# Altium schematic sheet cpu.SchDoc
size A4
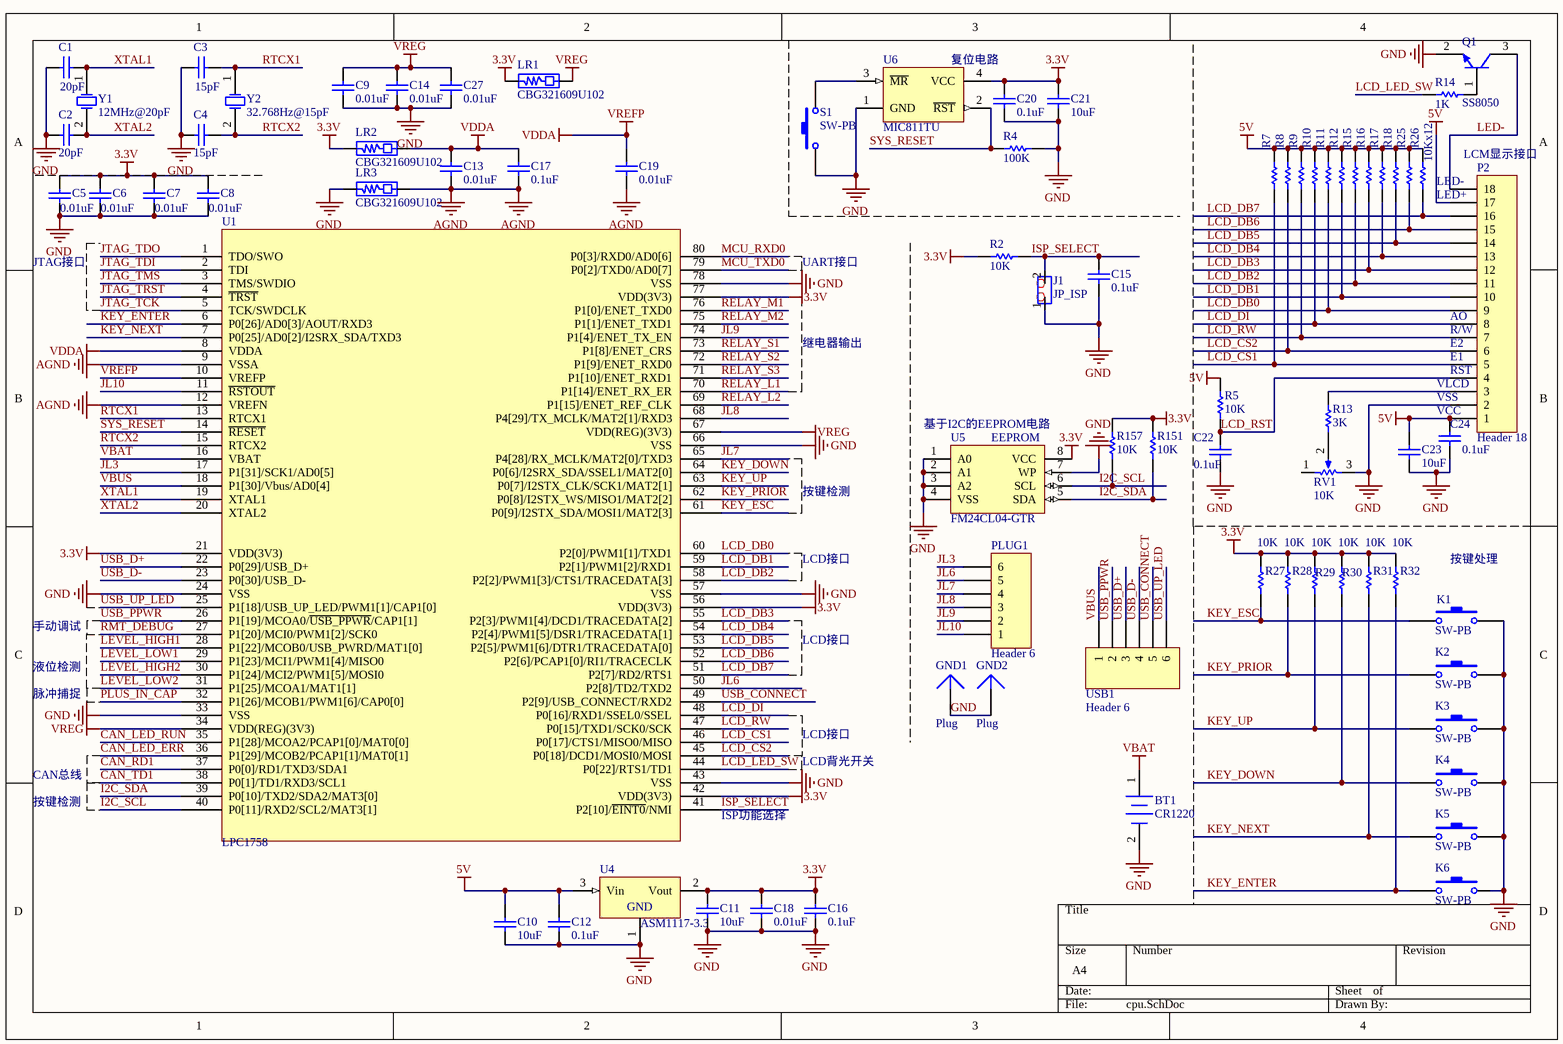
[diagram p0: cpu.SchDoc]

## Parts
BT1  CR1220  [BAT-CR1220A]
C1  20pF  [CAPC2012M]
C2  20pF  [CAPC2012M]
C3  15pF  [CAPC2012M]
C4  15pF  [CAPC2012M]
C5  0.01uF  [CAPC2012M]
C6  0.01uF  [CAPC2012M]
C7  0.01uF  [CAPC2012M]
C8  0.01uF  [CAPC2012M]
C9  0.01uF  [CAPC2012M]
C10  10uF  [CAPC2012M]
C11  10uF  [CAPC2012M]
C12  0.1uF  [CAPC2012M]
C13  0.01uF  [CAPC2012M]
C14  0.01uF  [CAPC2012M]
C15  0.1uF  [CAPC2012M]
C16  0.1uF  [CAPC2012M]
C17  0.1uF  [CAPC2012M]
C18  0.01uF  [CAPC2012M]
C19  0.01uF  [CAPC2012M]
C20  0.1uF  [CAPC2012M]
C21  10uF  [CAPC2012M]
C22  0.1uF  [CAPC2012M]
C23  10uF  [CAPC2012M]
C24  0.1uF  [CAPC2012M]
C27  0.01uF  [CAPC2012M]
GND1  Plug  [PIN1]
GND2  Plug  [PIN1]
J1  JP_ISP  [DS-01]
K1  SW-PB  [PBST-4S]
K2  SW-PB  [PBST-4S]
K3  SW-PB  [PBST-4S]
K4  SW-PB  [PBST-4S]
K5  SW-PB  [PBST-4S]
K6  SW-PB  [PBST-4S]
LR1  CBG321609U102  [RESC3216M]
LR2  CBG321609U102  [RESC3216M]
LR3  CBG321609U102  [RESC3216M]
P2  Header 18  [HDR1X18]
PLUG1  Header 6  [HDR1X6]
Q1  SS8050  [SOT-23_N]
R2  10K  [RESC2012M]
R4  100K  [RESC2012M]
R5  10K  [RESC2012M]
R7  10K  [RESC2012M]  (value not drawn)
R8  10K  [RESC2012M]  (value not drawn)
R9  10K  [RESC2012M]  (value not drawn)
R10  10K  [RESC2012M]  (value not drawn)
R11  10K  [RESC2012M]  (value not drawn)
R12  10K  [RESC2012M]  (value not drawn)
R13  3K  [RESC2012M]
R14  1K  [RESC2012M]
R15  10K  [RESC2012M]  (value not drawn)
R16  10K  [RESC2012M]  (value not drawn)
R17  10K  [RESC2012M]  (value not drawn)
R18  10K  [RESC2012M]  (value not drawn)
R25  10K  [RESC2012M]  (value not drawn)
R26  10K  [RESC2012M]  (value not drawn)
R27  10K  [RESC2012M]
R28  10K  [RESC2012M]
R29  10K  [RESC2012M]
R30  10K  [RESC2012M]
R31  10K  [RESC2012M]
R32  10K  [RESC2012M]
R151  10K  [RESC2012M]
R157  10K  [RESC2012M]
RV1  10K  [VR5S]
S1  SW-PB  [DPST-4S]
U1  LPC1758  [LQFP80_M]
U4  ASM1117-3.3  [SOT-223]
U5  FM24CL04-GTR  [SO-8]
U6  MIC811TU  [SOT143_N]
USB1  Header 6  [HDR1X6]
Y1  12MHz@20pF  [HC_SOC]
Y2  32.768Hz@15pF  [HC-RTC]

## Nets
3.3V: C5.2 C6.2 C7.2 C8.2 C11.2 C16.2 C18.2 C20.2 C21.2 LR1.1 LR2.1 R2.1 R27.2 R28.2 R29.2 R30.2 R31.2 R32.2 R151.2 R157.1 U1.21(VDD(3V3)) U1.42(VDD(3V3)) U1.56(VDD(3V3)) U1.77(VDD(3V3)) U4.2(Vout) U5.8(VCC) U6.4(VCC)
5V: C10.2 C12.2 C23.2 C24.1 P2.1 P2.17 R5.1 R7.1 R8.1 R9.1 R10.1 R11.1 R12.1 R15.1 R16.1 R17.1 R18.1 R25.1 R26.1 U4.3(Vin)
AGND: C13.1 C17.1 C19.1 LR3.2 U1.9(VSSA) U1.12(VREFN)
GND: BT1.2(-) C1.2 C2.2 C3.2 C4.2 C5.1 C6.1 C7.1 C8.1 C9.1 C10.1 C11.1 C12.1 C14.1 C15.2 C16.1 C18.1 C20.1 C21.1 C22.2 C23.1 C24.2 C27.1 GND1.1 GND2.1 J1.1 K1.2 K2.2 K3.2 K4.2 K5.2 K6.2 LR3.1 P2.2 Q1.2(E) R4.2 RV1.3(BOT) S1.1 U1.24(VSS) U1.33(VSS) U1.43(VSS) U1.57(VSS) U1.66(VSS) U1.78(VSS) U4.1(GND) U5.1(A0) U5.2(A1) U5.3(A2) U5.4(VSS) U5.7(WP) U6.1(GND)
VBAT: BT1.1(+) U1.16(VBAT)
VREFP: C13.2 C17.2 C19.2 LR2.2 U1.8(VDDA) U1.10(VREFP)  [also labelled VDDA]
VREG: C9.2 C14.2 C27.2 LR1.2 U1.34(VDD(REG)(3V3)) U1.67(VDD(REG)(3V3))
CAN_LED_ERR: U1.36(P1[29]/MCOB2/PCAP1[1]/MAT0[1])
CAN_LED_RUN: U1.35(P1[28]/MCOA2/PCAP1[0]/MAT0[0])
CAN_RD1: U1.37(P0[0]/RD1/TXD3/SDA1)
CAN_TD1: U1.38(P0[1]/TD1/RXD3/SCL1)
I2C_SCL: R157.2 U1.40(P0[11]/RXD2/SCL2/MAT3[1]) U5.6(SCL)
I2C_SDA: R151.1 U1.39(P0[10]/TXD2/SDA2/MAT3[0]) U5.5(SDA)
ISP_SELECT: C15.1 J1.2 R2.2 U1.41(P2[10]/~{EINT0}/NMI)
JL3: PLUG1.6 U1.17(P1[31]/SCK1/AD0[5])
JL6: PLUG1.5 U1.50(P2[8]/TD2/TXD2)
JL7: PLUG1.4 U1.65(P4[28]/RX_MCLK/MAT2[0]/TXD3)
JL8: PLUG1.3 U1.68(P4[29]/TX_MCLK/MAT2[1]/RXD3)
JL9: PLUG1.2 U1.74(P1[4]/ENET_TX_EN)
JL10: PLUG1.1 U1.11(~{RSTOUT})
JTAG_TCK: U1.5(TCK/SWDCLK)
JTAG_TDI: U1.2(TDI)
JTAG_TDO: U1.1(TDO/SWO)
JTAG_TMS: U1.3(TMS/SWDIO)
JTAG_TRST: U1.4(~{TRST})
KEY_DOWN: K4.1 R30.1 U1.64(P0[6]/I2SRX_SDA/SSEL1/MAT2[0])
KEY_ENTER: K6.1 R32.1 U1.6(P0[26]/AD0[3]/AOUT/RXD3)
KEY_ESC: K1.1 R27.1 U1.61(P0[9]/I2STX_SDA/MOSI1/MAT2[3])
KEY_NEXT: K5.1 R31.1 U1.7(P0[25]/AD0[2]/I2SRX_SDA/TXD3)
KEY_PRIOR: K2.1 R28.1 U1.62(P0[8]/I2STX_WS/MISO1/MAT2[2])
KEY_UP: K3.1 R29.1 U1.63(P0[7]/I2STX_CLK/SCK1/MAT2[1])
LCD_CS1: P2.5 R7.2 U1.46(P0[17]/CTS1/MISO0/MISO)
LCD_CS2: P2.6 R8.2 U1.45(P0[18]/DCD1/MOSI0/MOSI)
LCD_DB0: P2.9 R11.2 U1.60(P2[0]/PWM1[1]/TXD1)
LCD_DB1: P2.10 R12.2 U1.59(P2[1]/PWM1[2]/RXD1)
LCD_DB2: P2.11 R15.2 U1.58(P2[2]/PWM1[3]/CTS1/TRACEDATA[3])
LCD_DB3: P2.12 R16.2 U1.55(P2[3]/PWM1[4]/DCD1/TRACEDATA[2])
LCD_DB4: P2.13 R17.2 U1.54(P2[4]/PWM1[5]/DSR1/TRACEDATA[1])
LCD_DB5: P2.14 R18.2 U1.53(P2[5]/PWM1[6]/DTR1/TRACEDATA[0])
LCD_DB6: P2.15 R25.2 U1.52(P2[6]/PCAP1[0]/RI1/TRACECLK)
LCD_DB7: P2.16 R26.2 U1.51(P2[7]/RD2/RTS1)
LCD_DI: P2.8 R10.2 U1.48(P0[16]/RXD1/SSEL0/SSEL)
LCD_LED_SW: R14.1 U1.44(P0[22]/RTS1/TD1)
LCD_RST: C22.1 P2.4 R5.2
LCD_RW: P2.7 R9.2 U1.47(P0[15]/TXD1/SCK0/SCK)
LED-: P2.18 Q1.3(C)
LEVEL_HIGH1: U1.28(P1[22]/MCOB0/USB_PWRD/MAT1[0])
LEVEL_HIGH2: U1.30(P1[24]/MCI2/PWM1[5]/MOSI0)
LEVEL_LOW1: U1.29(P1[23]/MCI1/PWM1[4]/MISO0)
LEVEL_LOW2: U1.31(P1[25]/MCOA1/MAT1[1])
MCU_RXD0: U1.80(P0[3]/RXD0/AD0[6])
MCU_TXD0: U1.79(P0[2]/TXD0/AD0[7])
PLUS_IN_CAP: U1.32(P1[26]/MCOB1/PWM1[6]/CAP0[0])
RELAY_L1: U1.70(P1[14]/ENET_RX_ER)
RELAY_L2: U1.69(P1[15]/ENET_REF_CLK)
RELAY_M1: U1.76(P1[0]/ENET_TXD0)
RELAY_M2: U1.75(P1[1]/ENET_TXD1)
RELAY_S1: U1.73(P1[8]/ENET_CRS)
RELAY_S2: U1.72(P1[9]/ENET_RXD0)
RELAY_S3: U1.71(P1[10]/ENET_RXD1)
RMT_DEBUG: U1.27(P1[20]/MCI0/PWM1[2]/SCK0)
RTCX1: C3.1 U1.13(RTCX1) Y2.1(OSC1)
RTCX2: C4.1 U1.15(RTCX2) Y2.2(OSC2)
SYS_RESET: R4.1 U1.14(~{RESET}) U6.2(~{RST})
USB_CONNECT: U1.49(P2[9]/USB_CONNECT/RXD2) USB1.5
USB_D+: U1.22(P0[29]/USB_D+) USB1.3
USB_D-: U1.23(P0[30]/USB_D-) USB1.4
USB_PPWR: U1.26(P1[19]/MCOA0/~{USB_PPWR}/CAP1[1]) USB1.2
USB_UP_LED: U1.25(P1[18]/USB_UP_LED/PWM1[1]/CAP1[0]) USB1.6
VBUS: U1.18(P1[30]/Vbus/AD0[4]) USB1.1
XTAL1: C1.1 U1.19(XTAL1) Y1.1(OSC1)
XTAL2: C2.1 U1.20(XTAL2) Y1.2(OSC2)
NetP2_3: P2.3 R13.2
NetQ1_1: Q1.1(B) R14.2
NetR13_1: R13.1 RV1.2(TAP)
NetS1_2: S1.2 U6.3(~{MR})

Not connected (* = marked no-connect by the designer): RV1 1(TOP)

## Notes on the sheet
- (near U6) 复位电路
- LED-
- (near R26) 10Kx12
- LCM显示接口
- LED+
- JTAG接口
- UART接口
- (near P2) AO
- 继电器输出
- (near P2) VLCD
- (near P2) R/W
- (near P2) E1
- (near P2) E2
- (near P2) RST
- (near U5) 基于I2C的EEPROM电路
- (near U5) EEPROM
- VSS
- VCC
- 按键检测
- LCD接口
- 按键处理
- 手动调试
- 脉冲捕捉
- 液位检测
- CAN总线
- LCD背光开关
- (near U1) ISP功能选择

## Library data of the parts
BT1 = Battery: Battery holder; Published: 24-Mar-1999; LatestRevisionDate: 17-Jul-2002; LatestRevisionNote: Re-released for DXP Platform.; PackageReference: BAT-2; Publisher: Altium Limited
C1-C4 = Cap: Capacitor; Value: 100pF; Published: 8-Jun-2000; LatestRevisionDate: 17-Jul-2002; LatestRevisionNote: Re-released for DXP Platform.; PackageReference: RAD-0.3; Publisher: Altium Limited
C5-C24 C27 = Cap: Capacitor; Value: 1nF; Published: 8-Jun-2000; LatestRevisionDate: 17-Jul-2002; LatestRevisionNote: Re-released for DXP Platform.; PackageReference: RAD-0.3; Publisher: Altium Limited
J1 = JK2H: Dial Switch pitch 7.62mm
K1-K6 = SW-PB: Push Button ,6mm(L)x6mm(W)x22mm(H); Published: 24-Mar-1999; LatestRevisionDate: 17-Jul-2002; LatestRevisionNote: Re-released for DXP Platform.; PackageReference: SPST-2; Publisher: Altium Limited
LR1-LR3 = BLM10/11/21/31/41: EMI FILTERS,DC Resistance max.0.05~1.5 ohms,10 ~ 1000 ohms at 100MHz  Frequency
P2 = Header 18H: 'Female Header,Single Row Straight, 20-Pin,Pitch 2.54mm,black; LatestRevisionDate: 17-Jul-2002; LatestRevisionNote: Re-released for DXP Platform.; Publisher: Altium Limited
PLUG1 USB1 = Header 6: Header, 6-Pin; LatestRevisionDate: 17-Jul-2002; LatestRevisionNote: Re-released for DXP Platform.; Publisher: Altium Limited
Q1 = PMMT491A: NPN BISS Transistor; Published: 17-Sep-2003; LatestRevisionDate: 12-Dec-2006; LatestRevisionNote: IPC-7351 Footprint Added.; DatasheetVersion: 11-Jun-2001; PackageVersion: May-1999; PackageReference: SOT23; Publisher: Altium Limited; PackageDescription: 3-Pin SOT-23 Package 0.95 mm Pitch, 2.3 mm Lead Span; ComponentLink1Description: Manufacturer Link; ComponentLink1URL: http://www.semiconductors.philips.com/; ComponentLink2Description: Datasheet; ComponentLink2URL: http://www.semiconductors.philips.com/acrobat/datasheets/PMMT491A_5.pdf
R2 R5 R7-R12 R15-R18 R25-R32 R151 R157 = Res1: Resistor; Published: 8-Jun-2000; LatestRevisionDate: 17-Jul-2002; LatestRevisionNote: Re-released for DXP Platform.; PackageReference: AXIAL-0.3; Publisher: Altium Limited; Value: 10K
R4 R13 R14 = Res1: Resistor; Value: 10K; Published: 8-Jun-2000; LatestRevisionDate: 17-Jul-2002; LatestRevisionNote: Re-released for DXP Platform.; PackageReference: AXIAL-0.3; Publisher: Altium Limited
RV1 = RPot-A: Potentiometer; Sim Note: Enter the Resistance value and the set point into parameter fields.; Set Position: 0.5; Value: 1K; Published: 8-Jun-2000; LatestRevisionDate: 17-Jul-2002; LatestRevisionNote: Re-released for DXP Platform.; PackageReference: VR5; Publisher: Altium Limited
S1 = SW-PB: Push Button ,2mm(L)x2mm(W)x10mm(H); Published: 24-Mar-1999; LatestRevisionDate: 17-Jul-2002; LatestRevisionNote: Re-released for DXP Platform.; PackageReference: SPST-2; Publisher: Altium Limited
U4 = LM1117T-5.0: 800mA Low-Dropout Linear Regulator
U5 = CAT24W02: Serial EEPROM
U6 = MAX811-EUS-T: 4-Pin 礟 Voltage Monitors with Manual Reset Input; Published: 16-Jan-2001; LatestRevisionDate: 29-May-2009; LatestRevisionNote: IPC-7351 Footprint Added.; DatasheetVersion: Feb-1998; PackageVersion: Feb-1998; PackageReference: SOT143; Publisher: Altium Limited; PackageDescription: 4-Pin SOT-143 Package 1.9 mm Pitch, 2.3 mm Lead Span; ComponentLink1Description: Manufacturer Link; ComponentLink1URL: http://www.maxim-ic.com/; ComponentLink2Description: Datasheet; ComponentLink2URL: http://pdfserv.maxim-ic.com/en/ds/MAX811-MAX812.pdf
Y1 Y2 = XTAL: Crystal Oscillator; Published: 8-Jun-2000; LatestRevisionDate: 17-Jul-2002; LatestRevisionNote: Re-released for DXP Platform.; PackageReference: R38; Publisher: Altium Limited
GND1 GND2 = Plug: LatestRevisionDate: 17-Jul-2002; LatestRevisionNote: Re-released for DXP Platform.; Publisher: Altium Limited